# Altium schematic sheet AMP_LO.SchDoc
size A; SheetNumber: 7; SheetTotal: 9
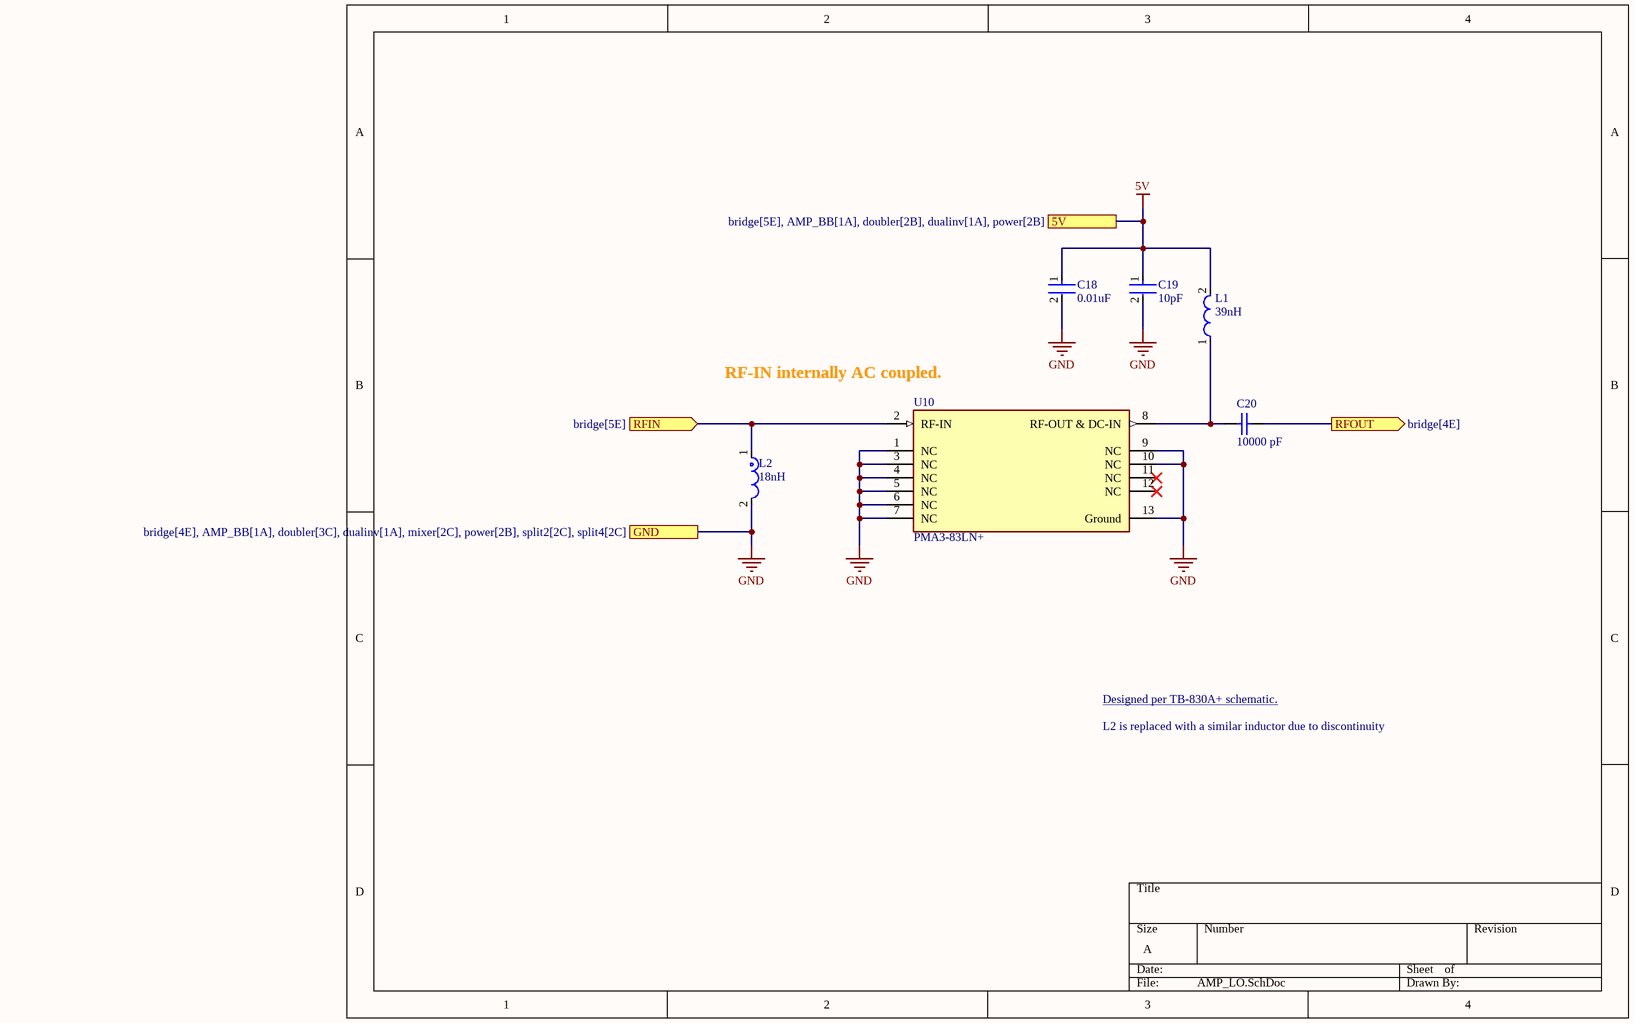
[diagram p0: AMP_LO.SchDoc]

## Parts
C18  0.01uF  [FP-C0402-BB-MFG]
C19  10pF  [FP-GJM155-0_05-IPC_A]
C20  10000 pF  [CAPC1005X55X25ML05T10]
L1  39nH  [FP-LQW15AN_00-W0_5-0_1-MFG]
L2  18nH  [FP-LQG15HH_02-MFG]
U10  PMA3-83LN+  [FP-DQ1225-MFG]

## Ports
5V (see bridge[5E], AMP_BB[1A], doubler[2B], dualinv[1A], power[2B]), GND (see bridge[4E], AMP_BB[1A], doubler[3C], dualinv[1A], mixer[2C], power[2B], split2[2C], split4[2C]), RFIN (in, see bridge[5E]), RFOUT (out, see bridge[4E])

## Nets
5V: C18.1 C19.1 L1.2 ; port 5V
GND: C18.2 C19.2 L2.2 U10.1(NC) U10.3(NC) U10.4(NC) U10.5(NC) U10.6(NC) U10.7(NC) U10.9(NC) U10.10(NC) U10.13(Ground) ; port GND
RFIN: L2.1 U10.2(RF-IN) ; port RFIN
RFOUT: C20.2 ; port RFOUT
NetC20_1: C20.1 L1.1 U10.8(RF-OUT_&_DC-IN)

Not connected (* = marked no-connect by the designer): U10 11(NC)* 12(NC)*

## Notes on the sheet
- (near U10) RF-IN internally AC coupled.
- Designed per TB-830A+ schematic. <https://www.minicircuits.com/pdfs/PMA3-83LN+.pdf>
- L2 is replaced with a similar inductor due to discontinuity

## Library data of the parts
C18 = CMP-2008-02109-2: CAP CER 10000PF 50V X7R 0402; Manufacturer: Murata; Part Number: GCM155R71H103KA55D; Tolerance: 0.1; Value: 10,000 pF; Material: Ceramic; Supplier 1: Arrow Electronics; Supplier Part Number 1: GCM155R71H103KA55D; Height: 0.55mm; Manufacturer Part Number: GCM155R71H103KA55D; Temperature Range Low: -55°C; ComponentLink2URL: https://content.kemet.com/datasheets/KEM_C1002_X7R_SMD.pdf; Temperature Characteristic: X7R; Automotive: No; Device Class L2: Capacitors; ComponentLink2Description: Datasheet; Voltage Rating: 50 V; Capacitance: 10,000 pF; Temperature: -55°C to +125°C
C19 = CMP-2008-03797-2: Multi-Layer Ceramic Capacitor 10pF C0G  ±5% 0402 Paper T/R; Manufacturer: Murata; Part Number: GJM1555C1H100JB01D; Voltage Rating (DC): 50V; Mount: Surface Mount; Width: 0.02inch; Height: 0.5mm; Termination: SMD/SMT; Capacitance: 10pF; Packaging: Tape and Reel; Case Code (Metric): 1005; Depth: 0.5mm; Min Operating Temperature: -55°C; Case/Package: 0402; Voltage Rating: 50V; Tolerance: 5%; Lead Free: Lead Free; Package Quantity: 1; Case Code (Imperial): 0402; Radiation Hardening: No; Length: 1mm; Voltage: 50V; Dielectric: C0G; Thickness: 0.022inch; Max Operating Temperature: 125°C; Supplier 1: Arrow Electronics; Supplier Part Number 1: GJM1555C1H100JB01D
C20 = CNP-CAP-10000PF-RF: CAP CER 10000PF 16V X7R 0402, RF Series; Manufacturer: KYOCERA AVX; Part Number: 520L103KT16T; Supplier 1: Mouser; Supplier Part Number 1: 81-RDER72H473K2K1H3B
L1 = CMP-06042-002147-1: Wire Wound RF Inductor 39nH ±2% 250mA 0.7Ω 0402 (1005); Part Number: LQW15AN39NG00D; Manufacturer: Murata; Core Material: Air; Shielding: Unshielded; Test Frequency: 100MHz; Self Resonant Frequency: 3GHz; DC Resistance (DCR): 700mR; Current: 750mA; Q Factor: 25; Lead Free: Lead Free; Case/Package: 0402; Packaging: Tape and Reel; Inductance: 39nH; Height: 0.5mm; Tolerance: 2%; Max Operating Temperature: 125°C; Max DC Current: 250mA; Case Code (Metric): 1005; REACH SVHC: No SVHC; Number of Pins: 2; Radiation Hardening: No; Military Standard: Not; Min Operating Temperature: -55°C; Termination: SMD/SMT; Inductance Tolerance: 2%; Mount: Surface Mount; Case Code (Imperial): 0402; Package Quantity: 1; DC Current: 250mA; Depth: 0.6mm; Weight: 2.8E-05oz; Width: 0.5mm; Current Rating: 250mA; Length: 1mm; Supplier 1: Arrow Electronics; Supplier Part Number 1: LQW15AN39NG00D
L2 = CMP-06042-000668-1: Multilayer type RF Inductor 18nH ±5% 0.36Ω 400mA 0402; Part Number: LQG15HS18NJ02D; Manufacturer: Murata; DC Current: 300mA; Test Frequency: 100MHz; Self Resonant Frequency: 2.2GHz; Shielding: Unshielded; Core Material: Air; DC Resistance (DCR): 360mR; Q Factor: 8; Inductance: 18nH; Military Standard: Not; REACH SVHC: No SVHC; Tolerance: 5%; Inductance Tolerance: 5%; Weight: 2.3E-05oz; Lead Free: Lead Free; Depth: 0.55mm; Current Rating: 300mA; Max DC Current: 300mA; Max Operating Temperature: 125°C; Length: 0.039inch; Min Operating Temperature: -55°C; Width: 0.5mm; Radiation Hardening: No; Termination: SMD/SMT; Height: 0.5mm; Package Quantity: 10000; Packaging: Tape and Reel; Case/Package: 0402; Case Code (Imperial): 0402; Mount: Surface Mount; Height - Seated (Max): 0.022inch; Case Code (Metric): 1005; Supplier 1: Arrow Electronics; Supplier Part Number 1: LQG15HS18NJ02D
U10 = CMP-199891-000002-1: SMT LOW NOISE AMPLIFIER, 500 - 8; Manufacturer: Mini-Circuits; Part Number: PMA3-83LN+; Supplier 1: Digikey; Supplier Part Number 1: 3157-PMA3-83LN+CT-ND